# Altium project DARKYDEN.PrjPcb (part 18 of 18)

## Sheet CONNECTEUR_2.SchDoc: DARKYDEN_CONNECTEUR_2
size Letter; ApprovedBy: APPROUVÉ PAR; Author: Harold Malbrouck; Organization: Cegep Limoilou; Address1: 1300, 8e Avenue; Address2: Québec, QC; Address3: Canada; Address4: G1J 5L5; Revision: Rev.B; SheetNumber: 4; SheetTotal: 21
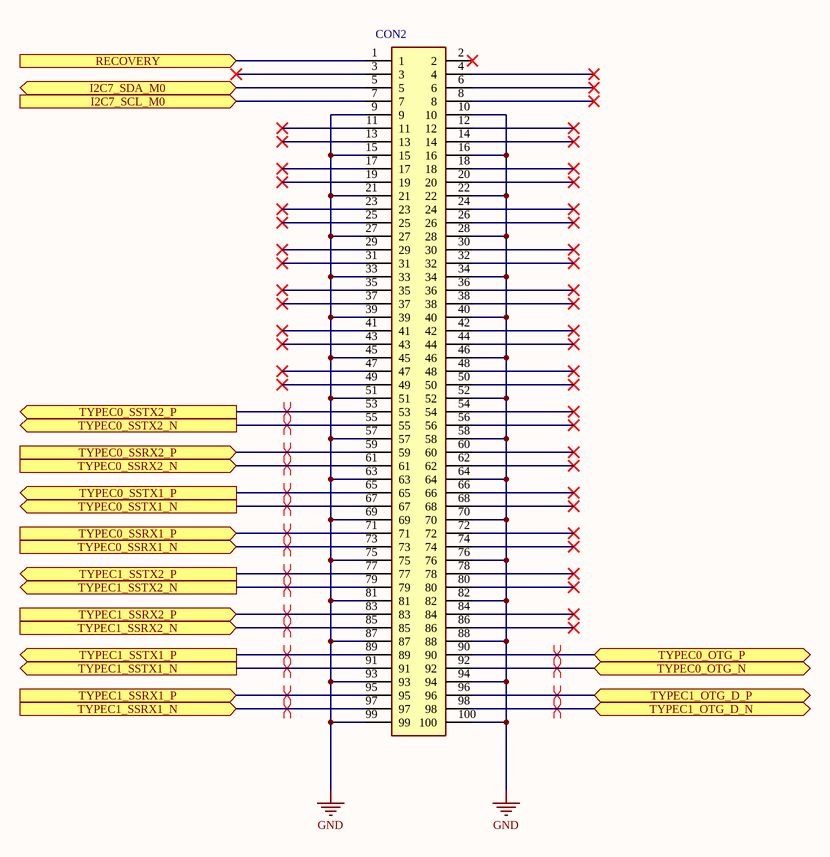
[diagram p18: CONNECTEUR_2.SchDoc]

### Parts
CON2  DF40HC  [DF40HC30100DS04V51_MOD]  (value not drawn)

### Ports
I2C7_SCL_M0 (in, see USBC_B[2D], USBC_B[3B]), I2C7_SDA_M0 (bidir, see USBC_B[3B], USBC_B[3D]), RECOVERY (in, see SystemCTL[1C]), TYPEC0_OTG_N (bidir, see USBC_A[2B]), TYPEC0_OTG_P (bidir, see USBC_A[2B]), TYPEC0_SSRX1_N (in, see USBC_A[1C], USBC_A[2B]), TYPEC0_SSRX1_P (in, see USBC_A[1C], USBC_A[2B]), TYPEC0_SSRX2_N (in, see USBC_A[2B], USBC_A[3C]), TYPEC0_SSRX2_P (in, see USBC_A[2B], USBC_A[3C]), TYPEC0_SSTX1_N (out, see USBC_A[2B], USBC_A[2C]), TYPEC0_SSTX1_P (out, see USBC_A[2B], USBC_A[2C]), TYPEC0_SSTX2_N (out, see USBC_A[2B], USBC_A[4C]), TYPEC0_SSTX2_P (out, see USBC_A[2B], USBC_A[4C]), TYPEC1_OTG_D_N (bidir, see USBC_B[2B]), TYPEC1_OTG_D_P (bidir, see USBC_B[2B]), TYPEC1_SSRX1_N (in, see USBC_B[1B], USBC_B[1C]), TYPEC1_SSRX1_P (in, see USBC_B[1B], USBC_B[1C]), TYPEC1_SSRX2_N (in, see USBC_B[1B], USBC_B[3C]), TYPEC1_SSRX2_P (in, see USBC_B[1B], USBC_B[3C]), TYPEC1_SSTX1_N (out, see USBC_B[1B], USBC_B[2C]), TYPEC1_SSTX1_P (out, see USBC_B[1B], USBC_B[2C]), TYPEC1_SSTX2_N (out, see USBC_B[1B], USBC_B[4C]), TYPEC1_SSTX2_P (out, see USBC_B[1B], USBC_B[4C])

### Nets
GND: CON2.9 CON2.10 CON2.15 CON2.16 CON2.21 CON2.22 CON2.27 CON2.28 CON2.33 CON2.34 CON2.39 CON2.40 CON2.45 CON2.46 CON2.51 CON2.52 CON2.57 CON2.58 CON2.63 CON2.64 CON2.69 CON2.70 CON2.75 CON2.76 CON2.81 CON2.82 CON2.87 CON2.88 CON2.93 CON2.94 CON2.99 CON2.100
I2C7_SCL_M0: CON2.7 ; port I2C7_SCL_M0
I2C7_SDA_M0: CON2.5 ; port I2C7_SDA_M0
RECOVERY: CON2.1 ; port RECOVERY
TYPEC0_OTG_N: CON2.92 ; port TYPEC0_OTG_N
TYPEC0_OTG_P: CON2.90 ; port TYPEC0_OTG_P
TYPEC0_SSRX1_N: CON2.73 ; port TYPEC0_SSRX1_N
TYPEC0_SSRX1_P: CON2.71 ; port TYPEC0_SSRX1_P
TYPEC0_SSRX2_N: CON2.61 ; port TYPEC0_SSRX2_N
TYPEC0_SSRX2_P: CON2.59 ; port TYPEC0_SSRX2_P
TYPEC0_SSTX1_N: CON2.67 ; port TYPEC0_SSTX1_N
TYPEC0_SSTX1_P: CON2.65 ; port TYPEC0_SSTX1_P
TYPEC0_SSTX2_N: CON2.55 ; port TYPEC0_SSTX2_N
TYPEC0_SSTX2_P: CON2.53 ; port TYPEC0_SSTX2_P
TYPEC1_OTG_D_N: CON2.98 ; port TYPEC1_OTG_D_N
TYPEC1_OTG_D_P: CON2.96 ; port TYPEC1_OTG_D_P
TYPEC1_SSRX1_N: CON2.97 ; port TYPEC1_SSRX1_N
TYPEC1_SSRX1_P: CON2.95 ; port TYPEC1_SSRX1_P
TYPEC1_SSRX2_N: CON2.85 ; port TYPEC1_SSRX2_N
TYPEC1_SSRX2_P: CON2.83 ; port TYPEC1_SSRX2_P
TYPEC1_SSTX1_N: CON2.91 ; port TYPEC1_SSTX1_N
TYPEC1_SSTX1_P: CON2.89 ; port TYPEC1_SSTX1_P
TYPEC1_SSTX2_N: CON2.79 ; port TYPEC1_SSTX2_N
TYPEC1_SSTX2_P: CON2.77 ; port TYPEC1_SSTX2_P

Not connected (* = marked no-connect by the designer): CON2 2* 3* 4* 6* 8* 11* 12* 13* 14* 17* 18* 19* 20* 23* 24* 25* 26* 29* 30* 31* 32* 35* 36* 37* 38* 41* 42* 43* 44* 47* 48* 49* 50* 54* 56* 60* 62* 66* 68* 72* 74* 78* 80* 84* 86*

### Layout directives
differential pair: TYPEC0_OTG_N, TYPEC0_OTG_P, TYPEC0_SSRX1_N, TYPEC0_SSRX1_P, TYPEC0_SSRX2_N, TYPEC0_SSRX2_P, TYPEC0_SSTX1_N, TYPEC0_SSTX1_P, TYPEC0_SSTX2_N, TYPEC0_SSTX2_P, TYPEC1_OTG_D_N, TYPEC1_OTG_D_P, TYPEC1_SSRX1_N, TYPEC1_SSRX1_P, TYPEC1_SSRX2_N, TYPEC1_SSRX2_P, TYPEC1_SSTX1_N, TYPEC1_SSTX1_P, TYPEC1_SSTX2_N, TYPEC1_SSTX2_P

### Notes on the sheet
- Titre :
- Conception :
- Date :
- Approbation :
- Heure :
- Révision :
- Feuille
- de
- Fichier :

### Library data of the parts
CON2 = DF40HC(3.0)-100DS-0.4V(51): Stacking Board Connector, DF40 Series, Receptacle, 0.4 mm, 100, Surface Mount, G; Manufacturer_Name: Hirose; Number of Positions: 100; Contact Resistance: 90mR; Contact Voltage Rating (AC): 30V; Current Rating: 300mA; Mated Stacking Heights: 3mm; Contact Pitch: 400um; Datasheet Link: https://componentsearchengine.com/Datasheets/1/DF40HC(3.0)-100DS-0.4V(51.pdf; Height: 3.05mm; Mouser Part Number: 798-DF40HC30100DS451; Mouser Price/Stock: https://www.mouser.co.uk/ProductDetail/Hirose-Connector/DF40HC3.0-100DS-0.4V51?qs=%252BAZVS4b%2FkgIV%252B3vHYy2dCA%3D%3D; Arrow Part Number: DF40HC(3.0)-100DS-0.4V(51; Arrow Price/Stock: https://www.arrow.com/en/products/df40hc-3.0-100ds-0.4v-51/hirose-electric; Supplier: Digikey; Supplier Part Number: 26-DF40HC(3.0)-100DS-0.4V(51)CT-ND; Manufacturer: Hirose; Manufacturer Part Number: DF40HC(3.0)-100DS-0.4V(51; RoHS: Yes; Category: Headers and Wire Housings; Stock: 5604; Pricing: 1=2.61, 10=2.219, 25=2.0796, 50=1.9804, 100=1.8858, 250=1.76764, 500=1.68326, 1000=1.6524 (USD); Mounting Technology: Surface Mount; Contact Plating: Gold; Contact Material: Nickel,Gold; Housing Color: Black; Min Operating Temperature: -35°C; Max Operating Temperature: 85°C; Package Quantity: 3000; Packaging: Tape and Reel; Number of Rows: 2; Connector Type: Receptacle; Series: DF40; Contact Voltage Rating (DC): 30V; Number of Contacts: 100; Orientation: Straight; Voltage Rating: 30V; Length: 22.6mm; Width: 3.38mm; ComponentLink1URL: https://datasheet.ciiva.com/13559/ed-df40-20140305-13559540.pdf?src-supplier=Mouser; ComponentLink1Description: https://datasheet.ciiva.com/13559/ed-df40-20140305-13559540.pdf?src-supplier=Mouser

## Sheet CONNECTEUR_3.SchDoc: DARKYDEN_CONNECTEUR_3
size Letter; ApprovedBy: APPROUVÉ PAR; Author: Harold Malbrouck; Organization: Cegep Limoilou; Address1: 1300, 8e Avenue; Address2: Québec, QC; Address3: Canada; Address4: G1J 5L5; Revision: Rev.C; SheetNumber: 5; SheetTotal: 21
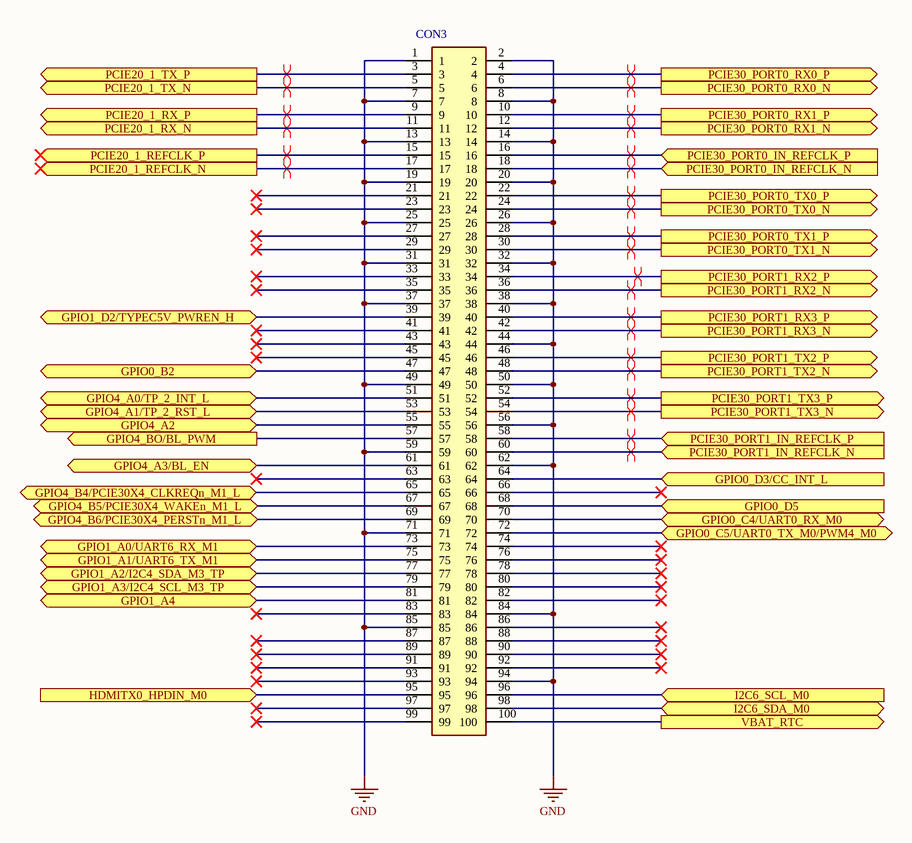
[diagram p19: CONNECTEUR_3.SchDoc]

### Parts
CON3  DF40HC  [DF40HC30100DS04V51_MOD]  (value not drawn)

### Ports
GPIO0_B2 (bidir, see WIFI[1B]), GPIO0_C4/UART0_RX_M0 (bidir, see WIFI[1B]), GPIO0_C5/UART0_TX_M0/PWM4_M0 (bidir, see WIFI[3B]), GPIO0_D3/CC_INT_L (in, see USBC_A[4B]), GPIO0_D5 (in, see USBC_B[4B]), GPIO1_A0/UART6_RX_M1 (bidir, see WIFI[3B]), GPIO1_A1/UART6_TX_M1 (bidir, see WIFI[3B]), GPIO1_A2/I2C4_SDA_M3_TP (bidir, see WIFI[3B]), GPIO1_A3/I2C4_SCL_M3_TP (bidir, see WIFI[3B]), GPIO1_A4 (bidir, see SystemCTL[3A]), GPIO1_D2/TYPEC5V_PWREN_H (bidir, see USBC_A[4A]), GPIO4_A0/TP_2_INT_L (bidir, see WIFI[1B]), GPIO4_A1/TP_2_RST_L (bidir, see WIFI[1B]), GPIO4_A2 (bidir, see WIFI[3B]), GPIO4_A3/BL_EN (bidir, see eDP[3C]), GPIO4_B4/PCIE30X4_CLKREQn_M1_L (bidir, see NVME[3B]), GPIO4_B5/PCIE30X4_WAKEn_M1_L (bidir, see NVME[3B]), GPIO4_B6/PCIE30X4_PERSTn_M1_L (bidir, see NVME[3B]), GPIO4_BO/BL_PWM (out, see eDP[3C]), HDMITX0_HPDIN_M0 (in, see eDP[3B]), I2C6_SCL_M0 (in, see USBC_A[2D], USBC_A[3B]), I2C6_SDA_M0 (bidir, see USBC_A[3B], USBC_A[3D]), PCIE20_1_REFCLK_N (out), PCIE20_1_REFCLK_P (out), PCIE20_1_RX_N (out, see WIFI[1B]), PCIE20_1_RX_P (out, see WIFI[1B]), PCIE20_1_TX_N (out, see WIFI[1B]), PCIE20_1_TX_P (out, see WIFI[1B]), PCIE30_PORT0_IN_REFCLK_N (in, see NVME[3D]), PCIE30_PORT0_IN_REFCLK_P (in, see NVME[3D]), PCIE30_PORT0_RX0_N (out, see NVME[1B]), PCIE30_PORT0_RX0_P (out, see NVME[1B]), PCIE30_PORT0_RX1_N (out, see NVME[1B]), PCIE30_PORT0_RX1_P (out, see NVME[1B]), PCIE30_PORT0_TX0_N (out, see NVME[1B]), PCIE30_PORT0_TX0_P (out, see NVME[1B]), PCIE30_PORT0_TX1_N (out, see NVME[1B]), PCIE30_PORT0_TX1_P (out, see NVME[1B]), PCIE30_PORT1_IN_REFCLK_N (in, see NVME[3D]), PCIE30_PORT1_IN_REFCLK_P (in, see NVME[3D]), PCIE30_PORT1_RX2_N (out, see NVME[1A]), PCIE30_PORT1_RX2_P (out, see NVME[1A]), PCIE30_PORT1_RX3_N (out, see NVME[1A]), PCIE30_PORT1_RX3_P (out, see NVME[1A]), PCIE30_PORT1_TX2_N (out, see NVME[1A]), PCIE30_PORT1_TX2_P (out, see NVME[1A]), PCIE30_PORT1_TX3_N (out, see NVME[1A]), PCIE30_PORT1_TX3_P (out, see NVME[1A]), VBAT_RTC (out, see SystemCTL[2C])

### Nets
GND: CON3.1 CON3.2 CON3.7 CON3.8 CON3.13 CON3.14 CON3.19 CON3.20 CON3.25 CON3.26 CON3.31 CON3.32 CON3.37 CON3.38 CON3.44 CON3.49 CON3.50 CON3.56 CON3.59 CON3.62 CON3.71 CON3.84 CON3.85 CON3.94
GPIO0_B2: CON3.47 ; port GPIO0_B2
GPIO0_C4/UART0_RX_M0: CON3.70 ; port GPIO0_C4/UART0_RX_M0
GPIO0_C5/UART0_TX_M0/PWM4_M0: CON3.72 ; port GPIO0_C5/UART0_TX_M0/PWM4_M0
GPIO0_D3/CC_INT_L: CON3.64 ; port GPIO0_D3/CC_INT_L
GPIO0_D5: CON3.68 ; port GPIO0_D5
GPIO1_A0/UART6_RX_M1: CON3.73 ; port GPIO1_A0/UART6_RX_M1
GPIO1_A1/UART6_TX_M1: CON3.75 ; port GPIO1_A1/UART6_TX_M1
GPIO1_A2/I2C4_SDA_M3_TP: CON3.77 ; port GPIO1_A2/I2C4_SDA_M3_TP
GPIO1_A3/I2C4_SCL_M3_TP: CON3.79 ; port GPIO1_A3/I2C4_SCL_M3_TP
GPIO1_A4: CON3.81 ; port GPIO1_A4
GPIO1_D2/TYPEC5V_PWREN_H: CON3.39 ; port GPIO1_D2/TYPEC5V_PWREN_H
GPIO4_A0/TP_2_INT_L: CON3.51 ; port GPIO4_A0/TP_2_INT_L
GPIO4_A1/TP_2_RST_L: CON3.53 ; port GPIO4_A1/TP_2_RST_L
GPIO4_A2: CON3.55 ; port GPIO4_A2
GPIO4_A3/BL_EN: CON3.61 ; port GPIO4_A3/BL_EN
GPIO4_B4/PCIE30X4_CLKREQn_M1_L: CON3.65 ; port GPIO4_B4/PCIE30X4_CLKREQn_M1_L
GPIO4_B5/PCIE30X4_WAKEn_M1_L: CON3.67 ; port GPIO4_B5/PCIE30X4_WAKEn_M1_L
GPIO4_B6/PCIE30X4_PERSTn_M1_L: CON3.69 ; port GPIO4_B6/PCIE30X4_PERSTn_M1_L
GPIO4_BO/BL_PWM: CON3.57 ; port GPIO4_BO/BL_PWM
HDMITX0_HPDIN_M0: CON3.95 ; port HDMITX0_HPDIN_M0
I2C6_SCL_M0: CON3.96 ; port I2C6_SCL_M0
I2C6_SDA_M0: CON3.98 ; port I2C6_SDA_M0
PCIE20_1_REFCLK_N: CON3.17 ; port PCIE20_1_REFCLK_N
PCIE20_1_REFCLK_P: CON3.15 ; port PCIE20_1_REFCLK_P
PCIE20_1_RX_N: CON3.11 ; port PCIE20_1_RX_N
PCIE20_1_RX_P: CON3.9 ; port PCIE20_1_RX_P
PCIE20_1_TX_N: CON3.5 ; port PCIE20_1_TX_N
PCIE20_1_TX_P: CON3.3 ; port PCIE20_1_TX_P
PCIE30_PORT0_IN_REFCLK_N: CON3.18 ; port PCIE30_PORT0_IN_REFCLK_N
PCIE30_PORT0_IN_REFCLK_P: CON3.16 ; port PCIE30_PORT0_IN_REFCLK_P
PCIE30_PORT0_RX0_N: CON3.6 ; port PCIE30_PORT0_RX0_N
PCIE30_PORT0_RX0_P: CON3.4 ; port PCIE30_PORT0_RX0_P
PCIE30_PORT0_RX1_N: CON3.12 ; port PCIE30_PORT0_RX1_N
PCIE30_PORT0_RX1_P: CON3.10 ; port PCIE30_PORT0_RX1_P
PCIE30_PORT0_TX0_N: CON3.24 ; port PCIE30_PORT0_TX0_N
PCIE30_PORT0_TX0_P: CON3.22 ; port PCIE30_PORT0_TX0_P
PCIE30_PORT0_TX1_N: CON3.30 ; port PCIE30_PORT0_TX1_N
PCIE30_PORT0_TX1_P: CON3.28 ; port PCIE30_PORT0_TX1_P
PCIE30_PORT1_IN_REFCLK_N: CON3.60 ; port PCIE30_PORT1_IN_REFCLK_N
PCIE30_PORT1_IN_REFCLK_P: CON3.58 ; port PCIE30_PORT1_IN_REFCLK_P
PCIE30_PORT1_RX2_N: CON3.36 ; port PCIE30_PORT1_RX2_N
PCIE30_PORT1_RX2_P: CON3.34 ; port PCIE30_PORT1_RX2_P
PCIE30_PORT1_RX3_N: CON3.42 ; port PCIE30_PORT1_RX3_N
PCIE30_PORT1_RX3_P: CON3.40 ; port PCIE30_PORT1_RX3_P
PCIE30_PORT1_TX2_N: CON3.48 ; port PCIE30_PORT1_TX2_N
PCIE30_PORT1_TX2_P: CON3.46 ; port PCIE30_PORT1_TX2_P
PCIE30_PORT1_TX3_N: CON3.54 ; port PCIE30_PORT1_TX3_N
PCIE30_PORT1_TX3_P: CON3.52 ; port PCIE30_PORT1_TX3_P
VBAT_RTC: CON3.100 ; port VBAT_RTC

Not connected (* = marked no-connect by the designer): CON3 21* 23* 27* 29* 33* 35* 41* 43* 45* 63* 66* 74* 76* 78* 80* 82* 83* 86* 87* 88* 89* 90* 91* 92* 93* 97* 99*

### Layout directives
differential pair: PCIE20_1_REFCLK_N, PCIE20_1_REFCLK_P, PCIE20_1_RX_N, PCIE20_1_RX_P, PCIE20_1_TX_N, PCIE20_1_TX_P, PCIE30_PORT0_IN_REFCLK_N, PCIE30_PORT0_IN_REFCLK_P, PCIE30_PORT0_RX0_N, PCIE30_PORT0_RX0_P, PCIE30_PORT0_RX1_N, PCIE30_PORT0_RX1_P, PCIE30_PORT0_TX0_N, PCIE30_PORT0_TX0_P, PCIE30_PORT0_TX1_N, PCIE30_PORT0_TX1_P, PCIE30_PORT1_IN_REFCLK_N, PCIE30_PORT1_IN_REFCLK_P, PCIE30_PORT1_RX2_N, PCIE30_PORT1_RX2_P, PCIE30_PORT1_RX3_N, PCIE30_PORT1_RX3_P, PCIE30_PORT1_TX2_N, PCIE30_PORT1_TX2_P, PCIE30_PORT1_TX3_N, PCIE30_PORT1_TX3_P

### Notes on the sheet
- Titre :
- Conception :
- Date :
- Approbation :
- Heure :
- Révision :
- Feuille
- de
- Fichier :

### Library data of the parts
CON3 = DF40HC(3.0)-100DS-0.4V(51): as CON2 on sheet CONNECTEUR_2; Datasheet Link: https://componentsearchengine.com/Datasheets/1/DF40HC(3.0)-100DS-0.4V(51.pdf; Height: 3.05mm; Mouser Part Number: 798-DF40HC30100DS451; Mouser Price/Stock: https://www.mouser.co.uk/ProductDetail/Hirose-Connector/DF40HC3.0-100DS-0.4V51?qs=%252BAZVS4b%2FkgIV%252B3vHYy2dCA%3D%3D; Arrow Part Number: DF40HC(3.0)-100DS-0.4V(51; Arrow Price/Stock: https://www.arrow.com/en/products/df40hc-3.0-100ds-0.4v-51/hirose-electric; Supplier: Digikey; Supplier Part Number: 26-DF40HC(3.0)-100DS-0.4V(51)CT-ND; Manufacturer: Hirose; Manufacturer Part Number: DF40HC(3.0)-100DS-0.4V(51; RoHS: Yes; Category: Headers and Wire Housings; Stock: 5604; Pricing: 1=2.61, 10=2.219, 25=2.0796, 50=1.9804, 100=1.8858, 250=1.76764, 500=1.68326, 1000=1.6524 (USD); Mounting Technology: Surface Mount; Contact Plating: Gold; Contact Material: Nickel,Gold; Housing Color: Black; Min Operating Temperature: -35°C; Max Operating Temperature: 85°C; Package Quantity: 3000; Packaging: Tape and Reel; Number of Rows: 2; Connector Type: Receptacle; Series: DF40; Contact Voltage Rating (DC): 30V; Number of Contacts: 100; Orientation: Straight; Voltage Rating: 30V; Length: 22.6mm; Width: 3.38mm; ComponentLink1URL: https://datasheet.ciiva.com/13559/ed-df40-20140305-13559540.pdf?src-supplier=Mouser; ComponentLink1Description: https://datasheet.ciiva.com/13559/ed-df40-20140305-13559540.pdf?src-supplier=Mouser

## Sheet CONNECTEUR_4.SchDoc: DARKYDEN_CONNECTEUR_4
size Letter; ApprovedBy: APPROUVÉ PAR; Author: Harold Malbrouck; Organization: Cegep Limoilou; Address1: 1300, 8e Avenue; Address2: Québec, QC; Address3: Canada; Address4: G1J 5L5; Revision: Rev.B; SheetNumber: 6; SheetTotal: 21
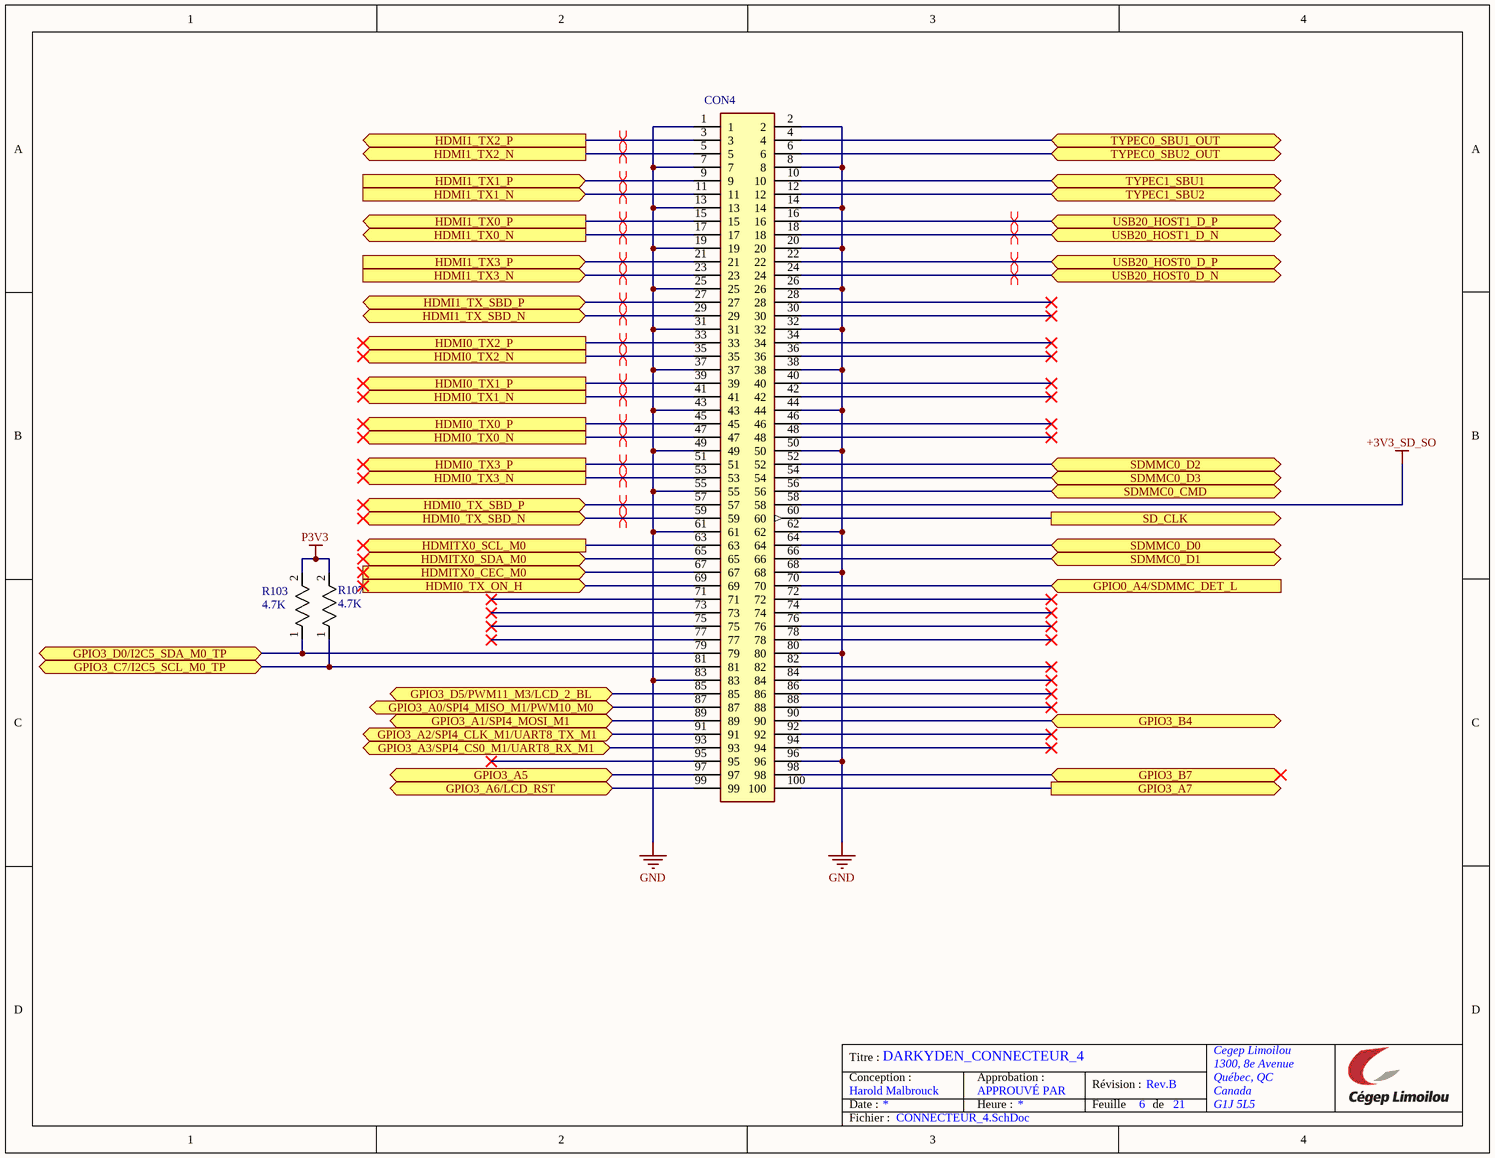
[diagram p20: CONNECTEUR_4.SchDoc]

### Parts
CON4  DF40HC  [DF40HC30100DS04V51_MOD]  (value not drawn)
R103  4.7K  [RESC1608X55N]
R107  4.7K  [RESC1608X55N]

### Ports
GPIO0_A4/SDMMC_DET_L (in, see SDCARD[1B]), GPIO3_A0/SPI4_MISO_M1/PWM10_M0 (bidir, see SystemCTL[2B]), GPIO3_A1/SPI4_MOSI_M1 (bidir, see SystemCTL[2B]), GPIO3_A2/SPI4_CLK_M1/UART8_TX_M1 (bidir, see SystemCTL[2B]), GPIO3_A3/SPI4_CS0_M1/UART8_RX_M1 (bidir, see SystemCTL[2B]), GPIO3_A5 (bidir, see SystemCTL[3A]), GPIO3_A6/LCD_RST (bidir, see WIFI[3B]), GPIO3_A7 (out, see eDP[1B]), GPIO3_B4 (bidir, see USBC_B[4A]), GPIO3_B7 (bidir), GPIO3_C7/I2C5_SCL_M0_TP (bidir, see POWERSYSTEM[2B]), GPIO3_D0/I2C5_SDA_M0_TP (bidir, see POWERSYSTEM[2B]), GPIO3_D5/PWM11_M3/LCD_2_BL (bidir, see WIFI[3B], WIFI[3C]), HDMI0_TX0_N (out), HDMI0_TX0_P (out), HDMI0_TX1_N (out), HDMI0_TX1_P (out), HDMI0_TX2_N (out), HDMI0_TX2_P (out), HDMI0_TX3_N (out), HDMI0_TX3_P (out), HDMI0_TX_ON_H (in), HDMI0_TX_SBD_N (bidir), HDMI0_TX_SBD_P (bidir), HDMI1_TX0_N (out, see eDP[3B]), HDMI1_TX0_P (out, see eDP[3B]), HDMI1_TX1_N (in, see eDP[3B]), HDMI1_TX1_P (in, see eDP[3B]), HDMI1_TX2_N (out, see eDP[3A]), HDMI1_TX2_P (out, see eDP[3A]), HDMI1_TX3_N (in, see eDP[3A]), HDMI1_TX3_P (in, see eDP[3A]), HDMI1_TX_SBD_N (bidir, see eDP[3B]), HDMI1_TX_SBD_P (bidir, see eDP[3B]), HDMITX0_CEC_M0 (in), HDMITX0_SCL_M0 (out), HDMITX0_SDA_M0 (bidir), SD_CLK (out, see SDCARD[3C]), SDMMC0_CMD (bidir, see SDCARD[3C]), SDMMC0_D0 (bidir, see SDCARD[1C]), SDMMC0_D1 (bidir, see SDCARD[1C]), SDMMC0_D2 (bidir, see SDCARD[4C]), SDMMC0_D3 (bidir, see SDCARD[4C]), TYPEC0_SBU1_OUT (bidir, see USBC_A[2A], USBC_A[3C]), TYPEC0_SBU2_OUT (bidir, see USBC_A[2B], USBC_A[3C]), TYPEC1_SBU1 (bidir, see USBC_B[1A], USBC_B[2C]), TYPEC1_SBU2 (bidir, see USBC_B[1A], USBC_B[2B]), USB20_HOST0_D_N (bidir, see USB2_0[1C]), USB20_HOST0_D_P (bidir, see USB2_0[1C]), USB20_HOST1_D_N (bidir, see WIFI[1A]), USB20_HOST1_D_P (bidir, see WIFI[1A])

### Nets
+3V3_SD_SO: CON4.58
GND: CON4.1 CON4.2 CON4.7 CON4.8 CON4.13 CON4.14 CON4.19 CON4.20 CON4.25 CON4.26 CON4.31 CON4.32 CON4.37 CON4.38 CON4.43 CON4.44 CON4.49 CON4.50 CON4.55 CON4.61 CON4.62 CON4.68 CON4.80 CON4.83 CON4.96
P3V3: R103.2 R107.2
GPIO0_A4/SDMMC_DET_L: CON4.70 ; port GPIO0_A4/SDMMC_DET_L
GPIO3_A0/SPI4_MISO_M1/PWM10_M0: CON4.87 ; port GPIO3_A0/SPI4_MISO_M1/PWM10_M0
GPIO3_A1/SPI4_MOSI_M1: CON4.89 ; port GPIO3_A1/SPI4_MOSI_M1
GPIO3_A2/SPI4_CLK_M1/UART8_TX_M1: CON4.91 ; port GPIO3_A2/SPI4_CLK_M1/UART8_TX_M1
GPIO3_A3/SPI4_CS0_M1/UART8_RX_M1: CON4.93 ; port GPIO3_A3/SPI4_CS0_M1/UART8_RX_M1
GPIO3_A5: CON4.97 ; port GPIO3_A5
GPIO3_A6/LCD_RST: CON4.99 ; port GPIO3_A6/LCD_RST
GPIO3_A7: CON4.100 ; port GPIO3_A7
GPIO3_B4: CON4.90 ; port GPIO3_B4
GPIO3_B7: CON4.98 ; port GPIO3_B7
GPIO3_C7/I2C5_SCL_M0_TP: CON4.81 R107.1 ; port GPIO3_C7/I2C5_SCL_M0_TP
GPIO3_D0/I2C5_SDA_M0_TP: CON4.79 R103.1 ; port GPIO3_D0/I2C5_SDA_M0_TP
GPIO3_D5/PWM11_M3/LCD_2_BL: CON4.85 ; port GPIO3_D5/PWM11_M3/LCD_2_BL
HDMI0_TX0_N: CON4.47 ; port HDMI0_TX0_N
HDMI0_TX0_P: CON4.45 ; port HDMI0_TX0_P
HDMI0_TX1_N: CON4.41 ; port HDMI0_TX1_N
HDMI0_TX1_P: CON4.39 ; port HDMI0_TX1_P
HDMI0_TX2_N: CON4.35 ; port HDMI0_TX2_N
HDMI0_TX2_P: CON4.33 ; port HDMI0_TX2_P
HDMI0_TX3_N: CON4.53 ; port HDMI0_TX3_N
HDMI0_TX3_P: CON4.51 ; port HDMI0_TX3_P
HDMI0_TX_ON_H: CON4.69 ; port HDMI0_TX_ON_H
HDMI0_TX_SBD_N: CON4.59 ; port HDMI0_TX_SBD_N
HDMI0_TX_SBD_P: CON4.57 ; port HDMI0_TX_SBD_P
HDMI1_TX0_N: CON4.17 ; port HDMI1_TX0_N
HDMI1_TX0_P: CON4.15 ; port HDMI1_TX0_P
HDMI1_TX1_N: CON4.11 ; port HDMI1_TX1_N
HDMI1_TX1_P: CON4.9 ; port HDMI1_TX1_P
HDMI1_TX2_N: CON4.5 ; port HDMI1_TX2_N
HDMI1_TX2_P: CON4.3 ; port HDMI1_TX2_P
HDMI1_TX3_N: CON4.23 ; port HDMI1_TX3_N
HDMI1_TX3_P: CON4.21 ; port HDMI1_TX3_P
HDMI1_TX_SBD_N: CON4.29 ; port HDMI1_TX_SBD_N
HDMI1_TX_SBD_P: CON4.27 ; port HDMI1_TX_SBD_P
HDMITX0_CEC_M0: CON4.67 ; port HDMITX0_CEC_M0
HDMITX0_SCL_M0: CON4.63 ; port HDMITX0_SCL_M0
HDMITX0_SDA_M0: CON4.65 ; port HDMITX0_SDA_M0
SD_CLK: CON4.60 ; port SD_CLK
SDMMC0_CMD: CON4.56 ; port SDMMC0_CMD
SDMMC0_D0: CON4.64 ; port SDMMC0_D0
SDMMC0_D1: CON4.66 ; port SDMMC0_D1
SDMMC0_D2: CON4.52 ; port SDMMC0_D2
SDMMC0_D3: CON4.54 ; port SDMMC0_D3
TYPEC0_SBU1_OUT: CON4.4 ; port TYPEC0_SBU1_OUT
TYPEC0_SBU2_OUT: CON4.6 ; port TYPEC0_SBU2_OUT
TYPEC1_SBU1: CON4.10 ; port TYPEC1_SBU1
TYPEC1_SBU2: CON4.12 ; port TYPEC1_SBU2
USB20_HOST0_D_N: CON4.24 ; port USB20_HOST0_D_N
USB20_HOST0_D_P: CON4.22 ; port USB20_HOST0_D_P
USB20_HOST1_D_N: CON4.18 ; port USB20_HOST1_D_N
USB20_HOST1_D_P: CON4.16 ; port USB20_HOST1_D_P

Not connected (* = marked no-connect by the designer): CON4 28* 30* 34* 36* 40* 42* 46* 48* 71* 72* 73* 74* 75* 76* 77* 78* 82* 84* 86* 88* 92* 94* 95*

### Layout directives
differential pair: HDMI0_TX0_N, HDMI0_TX0_P, HDMI0_TX1_N, HDMI0_TX1_P, HDMI0_TX2_N, HDMI0_TX2_P, HDMI0_TX3_N, HDMI0_TX3_P, HDMI0_TX_SBD_N, HDMI0_TX_SBD_P, HDMI1_TX0_N, HDMI1_TX0_P, HDMI1_TX1_N, HDMI1_TX1_P, HDMI1_TX2_N, HDMI1_TX2_P, HDMI1_TX3_N, HDMI1_TX3_P, HDMI1_TX_SBD_N, HDMI1_TX_SBD_P, USB20_HOST0_D_N, USB20_HOST0_D_P, USB20_HOST1_D_N, USB20_HOST1_D_P

### Notes on the sheet
- Titre :
- Conception :
- Date :
- Approbation :
- Heure :
- Révision :
- Feuille
- de
- Fichier :

### Library data of the parts
CON4 = DF40HC(3.0)-100DS-0.4V(51): as CON2 on sheet CONNECTEUR_2; Datasheet Link: https://componentsearchengine.com/Datasheets/1/DF40HC(3.0)-100DS-0.4V(51.pdf; Height: 3.05mm; Mouser Part Number: 798-DF40HC30100DS451; Mouser Price/Stock: https://www.mouser.co.uk/ProductDetail/Hirose-Connector/DF40HC3.0-100DS-0.4V51?qs=%252BAZVS4b%2FkgIV%252B3vHYy2dCA%3D%3D; Arrow Part Number: DF40HC(3.0)-100DS-0.4V(51; Arrow Price/Stock: https://www.arrow.com/en/products/df40hc-3.0-100ds-0.4v-51/hirose-electric; Supplier: Digikey; Supplier Part Number: 26-DF40HC(3.0)-100DS-0.4V(51)CT-ND; Manufacturer: Hirose; Manufacturer Part Number: DF40HC(3.0)-100DS-0.4V(51; RoHS: Yes; Category: Headers and Wire Housings; Stock: 5604; Pricing: 1=2.61, 10=2.219, 25=2.0796, 50=1.9804, 100=1.8858, 250=1.76764, 500=1.68326, 1000=1.6524 (USD); Mounting Technology: Surface Mount; Contact Plating: Gold; Contact Material: Nickel,Gold; Housing Color: Black; Min Operating Temperature: -35°C; Max Operating Temperature: 85°C; Package Quantity: 3000; Packaging: Tape and Reel; Number of Rows: 2; Connector Type: Receptacle; Series: DF40; Contact Voltage Rating (DC): 30V; Number of Contacts: 100; Orientation: Straight; Voltage Rating: 30V; Length: 22.6mm; Width: 3.38mm; ComponentLink1URL: https://datasheet.ciiva.com/13559/ed-df40-20140305-13559540.pdf?src-supplier=Mouser; ComponentLink1Description: https://datasheet.ciiva.com/13559/ed-df40-20140305-13559540.pdf?src-supplier=Mouser
R103 R107 = ERA-3AEB472V: 4.7K Ohm 0.1% 0.1W 0603 ±25ppm/°C Molded SMD Punched Carrier T/R; Mfr_Name: Panasonic; Voltage Rating: 75V; Value: 4.7kR; Power Rating: 100mW; Supplier: Digikey; Supplier Part Number: P4.7KDBCT-ND; Manufacturer: Panasonic; Manufacturer Part Number: ERA-3AEB472V; RoHS: Yes; Category: Chip SMD Resistors; Stock: 284751; Pricing: 1=0.1, 10=0.065, 50=0.0574, 100=0.0541, 500=0.0475, 1000=0.045 (USD); Mounting Technology: Surface Mount; Case/Package: 0603; Pins: 2; Contact Plating: Tin; Case Code (Metric): 1608; Case Code (Imperial): 0603; Min Operating Temperature: -55°C; Max Operating Temperature: 155°C; Packaging: Tape and Reel; Package Quantity: 5000; Termination: SMD/SMT; Series: ERA-3A; Tolerance: 0.1%; Resistor Type: Thin Film; Number of Terminations: 2; Temperature Coefficient: 25ppm/°C; Max Power Dissipation: 100mW; Voltage Rating (DC): 75V; Working Voltage: 75V; Construction: Rectangular; Resistance Tolerance: 0.1%; Technology: THIN FILM; Features: Automotive AEC-Q200; Length: 1.6mm; Width: 0.8mm; Height: 0.45mm; Depth: 0.8mm; Ratings: AEC-Q200; Radiation Hardening: No; Reach SVHC Compliant: No; RoHS Compliant: Yes; Military Standard: Not; Lead Free: Lead Free; ComponentLink1URL: https://datasheet.ciiva.com/11808/0900766b80fe20f7-11808039.pdf?src-supplier=Rs; ComponentLink1Description: https://datasheet.ciiva.com/11808/0900766b80fe20f7-11808039.pdf?src-supplier=Rs; ComponentLink2URL: https://datasheet.ciiva.com/29183/451124-da-01-en-widerstand-0603-era-29183789.pdf?src-supplier=Conrad; ComponentLink2Description: https://datasheet.ciiva.com/29183/451124-da-01-en-widerstand-0603-era-29183789.pdf?src-supplier=Conrad; ComponentLink3URL: https://datasheet.ciiva.com/22781/485442-22781497.pdf?src-supplier=Farnell; ComponentLink3Description: https://datasheet.ciiva.com/22781/485442-22781497.pdf?src-supplier=Farnell; ComponentLink4URL: https://datasheet.ciiva.com/43455/485442-43455227.pdf?src-supplier=Farnell; ComponentLink4Description: https://datasheet.ciiva.com/43455/485442-43455227.pdf?src-supplier=Farnell; ComponentLink5URL: https://datasheet.ciiva.com/9116/aoa0000ce26-9116681.pdf?src-supplier=Avnet; ComponentLink5Description: https://datasheet.ciiva.com/9116/aoa0000ce26-9116681.pdf?src-supplier=Avnet; ComponentLink6URL: https://datasheet.ciiva.com/9117/aoa0000ce26-9117707.pdf?src-supplier=Avnet; ComponentLink6Description: https://datasheet.ciiva.com/9117/aoa0000ce26-9117707.pdf?src-supplier=Avnet; ComponentLink7URL: https://datasheet.ciiva.com/48425/era-eng-tds-48425470.pdf?src-supplier=Distrelec; ComponentLink7Description: https://datasheet.ciiva.com/48425/era-eng-tds-48425470.pdf?src-supplier=Distrelec; ComponentLink8URL: https://datasheet.ciiva.com/46422/485442-46422693.pdf?src-supplier=Element14; ComponentLink8Description: https://datasheet.ciiva.com/46422/485442-46422693.pdf?src-supplier=Element14; ComponentLink9URL: https://datasheet.ciiva.com/30078/54aoa0000ce26-30078815.pdf?src-supplier=Onlinecomponents.com; ComponentLink9Description: https://datasheet.ciiva.com/30078/54aoa0000ce26-30078815.pdf?src-supplier=Onlinecomponents.com; ComponentLink10URL: https://datasheet.ciiva.com/22743/485442-22743061.pdf?src-supplier=Element14; ComponentLink10Description: https://datasheet.ciiva.com/22743/485442-22743061.pdf?src-supplier=Element14

## Nets that join several sheets
+1V8: SDCARD (R49.2), SystemCTL (5 pins), 1V8_3V3_5V (C67.2 IC7.5 TP_1V8.TP)
+3V3: USBC_A (C9.2 R4.1 R5.1 U3.4), USBC_B (5 pins), NVME (R18.2 R22.2), ETHERNET (R14.2 R15.2), eDP (C21.2 U13.1), USB2_0 (15 pins), SystemCTL (R77.2), USB2_0_Connector (J4.6 J4.8), 1V8_3V3_5V (10 pins)
+3V3_NVME: NVME (9 pins), POWER_PCie (7 pins)
+3V3_SD_SO: SDCARD (C35.2 C36.2 J7.4), CONNECTEUR_4 (CON4.58)
+3V3_WIFI: WIFI (WIFI.2 WIFI.4 WIFI.72 WIFI.74), POWER_PCie (7 pins)
+5V: USBC_A (7 pins), USBC_B (7 pins), NVME (C26.2 U16.1), USB2_0 (IC18.5 IC18.7 IC19.7 IC20.7), 1V8_3V3_5V (8 pins)
+12: 12V_PWR (5 pins), 1V8_3V3_5V (R79.1 R80.1 R84.1 R85.1), POWER_PCie (R93.1 R94.1 R98.1 R99.1), CONNECTEUR_1 (R6.2 R7.2)
GND: USBC_A (32 pins), USBC_B (32 pins), WIFI (13 pins), NVME (41 pins), ETHERNET (7 pins), SDCARD (11 pins), eDP (21 pins), USB2_0 (32 pins), SystemCTL (21 pins), USB2_0_Connector (17 pins), POWERSYSTEM (56 pins), BATTERY_GESTION (26 pins), 12V_PWR (24 pins), P3V3_PP5V_GESTION (17 pins), 1V8_3V3_5V (25 pins), POWER_PCie (18 pins), CONNECTEUR_1 (26 pins), CONNECTEUR_2 (32 pins), CONNECTEUR_3 (24 pins), CONNECTEUR_4 (25 pins)
P3V3: POWERSYSTEM (C87.2 U25.38), P3V3_PP5V_GESTION (C152.2 IC16.5), CONNECTEUR_4 (R103.2 R107.2)
PACK+: POWERSYSTEM (7 pins), BATTERY_GESTION (12 pins)
PP5V: POWERSYSTEM (U25.34 U25.35), P3V3_PP5V_GESTION (8 pins)
PWR1: USB2_0 (BR2.1 IC18.6 IC18.8 IC19.8), USB2_0_Connector (C168.1 C169.1 FB1.1)
PWR2: USB2_0 (BR3.1 IC19.5), USB2_0_Connector (C172.1 C173.1 FB3.1)
PWR3: USB2_0 (BR5.1 IC20.8), USB2_0_Connector (C176.1 C177.1 FB5.1)
PWR4: USB2_0 (BR4.1 IC20.5), USB2_0_Connector (C180.1 C181.1 FB7.1)
VCC_SYS: eDP (eDP1.2 eDP1.3 eDP1.4 eDP1.5), POWERSYSTEM (8 pins), 12V_PWR (10 pins), P3V3_PP5V_GESTION (5 pins)
BOOT_SARADC_IN0: SystemCTL (C43.1 R72.1), CONNECTEUR_1 (CON1.15)
DN1_OUT_N: USB2_0 (BR2.4 L20.3), USB2_0_Connector (J4.3)
DN1_OUT_P: USB2_0 (BR2.2 L20.4), USB2_0_Connector (J4.5)
DN2_OUT_N: USB2_0 (BR3.4 L21.3), USB2_0_Connector (Trackpad.5)
DN2_OUT_P: USB2_0 (BR3.2 L21.4), USB2_0_Connector (Trackpad.4)
DN3_OUT_N: USB2_0 (BR5.4 L23.3), USB2_0_Connector (USB1.2)
DN3_OUT_P: USB2_0 (BR5.2 L23.4), USB2_0_Connector (USB1.3)
DN4_OUT_N: USB2_0 (BR4.4 L22.3), USB2_0_Connector (USB2.2)
DN4_OUT_P: USB2_0 (BR4.2 L22.4), USB2_0_Connector (USB2.3)
GPIO0_A4/SDMMC_DET_L: SDCARD (R49.1 R50.1), CONNECTEUR_4 (CON4.70)
GPIO0_B2: WIFI (WIFI.21), CONNECTEUR_3 (CON3.47)
GPIO0_C4/UART0_RX_M0: WIFI (R41.1), CONNECTEUR_3 (CON3.70)
GPIO0_C5/UART0_TX_M0/PWM4_M0: WIFI (WIFI.20), CONNECTEUR_3 (CON3.72)
GPIO0_D3/CC_INT_L: USBC_A (U3.5), CONNECTEUR_3 (CON3.64)
GPIO0_D5: USBC_B (R13.1 U9.5), CONNECTEUR_3 (CON3.68)
GPIO1_A0/UART6_RX_M1: WIFI (WIFI.22), CONNECTEUR_3 (CON3.73)
GPIO1_A1/UART6_TX_M1: WIFI (WIFI.32), CONNECTEUR_3 (CON3.75)
GPIO1_A2/I2C4_SDA_M3_TP: WIFI (WIFI.36), CONNECTEUR_3 (CON3.77)
GPIO1_A3/I2C4_SCL_M3_TP: WIFI (WIFI.34), CONNECTEUR_3 (CON3.79)
GPIO1_A4: SystemCTL (IC4.2), CONNECTEUR_3 (CON3.81)
GPIO1_D2/TYPEC5V_PWREN_H: USBC_A (R173.2), CONNECTEUR_3 (CON3.39)
GPIO2_A6: WIFI (WIFI.13), CONNECTEUR_1 (CON1.79)
GPIO2_A7: WIFI (WIFI.15), CONNECTEUR_1 (CON1.81)
GPIO2_B0: WIFI (WIFI.17), CONNECTEUR_1 (CON1.83)
GPIO2_B1: WIFI (WIFI.19), CONNECTEUR_1 (CON1.85)
GPIO2_B2: WIFI (WIFI.11), CONNECTEUR_1 (CON1.87)
GPIO2_B3: WIFI (WIFI.9), CONNECTEUR_1 (CON1.89)
GPIO2_B7: WIFI (WIFI.8), CONNECTEUR_1 (CON1.99)
GPIO2_C0: WIFI (WIFI.10), CONNECTEUR_1 (CON1.21)
GPIO2_C3: WIFI (R42.2), CONNECTEUR_1 (CON1.27)
GPIO3_A0/SPI4_MISO_M1/PWM10_M0: SystemCTL (IC4.3), CONNECTEUR_4 (CON4.87)
GPIO3_A1/SPI4_MOSI_M1: SystemCTL (IC4.5), CONNECTEUR_4 (CON4.89)
GPIO3_A2/SPI4_CLK_M1/UART8_TX_M1: SystemCTL (IC4.6 R76.1), CONNECTEUR_4 (CON4.91)
GPIO3_A3/SPI4_CS0_M1/UART8_RX_M1: SystemCTL (IC4.7 R75.1), CONNECTEUR_4 (CON4.93)
GPIO3_A5: SystemCTL (IC4.1), CONNECTEUR_4 (CON4.97)
GPIO3_A6/LCD_RST: WIFI (WIFI.42), CONNECTEUR_4 (CON4.99)
GPIO3_A7: eDP (U13.3), CONNECTEUR_4 (CON4.100)
GPIO3_B4: USBC_B (R174.2), CONNECTEUR_4 (CON4.90)
GPIO3_C7/I2C5_SCL_M0_TP: POWERSYSTEM (U25.9), CONNECTEUR_4 (CON4.81 R107.1)
GPIO3_D0/I2C5_SDA_M0_TP: POWERSYSTEM (U25.8), CONNECTEUR_4 (CON4.79 R103.1)
GPIO3_D5/PWM11_M3/LCD_2_BL: WIFI (WIFI.54 WIFI.70), CONNECTEUR_4 (CON4.85)
GPIO4_A0/TP_2_INT_L: WIFI (WIFI.53), CONNECTEUR_3 (CON3.51)
GPIO4_A1/TP_2_RST_L: WIFI (WIFI.55), CONNECTEUR_3 (CON3.53)
GPIO4_A2: WIFI (WIFI.52), CONNECTEUR_3 (CON3.55)
GPIO4_A3/BL_EN: eDP (eDP1.9), CONNECTEUR_3 (CON3.61)
GPIO4_B4/PCIE30X4_CLKREQn_M1_L: NVME (R20.2), CONNECTEUR_3 (CON3.65)
GPIO4_B5/PCIE30X4_WAKEn_M1_L: NVME (R21.2), CONNECTEUR_3 (CON3.67)
GPIO4_B6/PCIE30X4_PERSTn_M1_L: NVME (R19.2), CONNECTEUR_3 (CON3.69)
GPIO4_BO/BL_PWM: eDP (eDP1.8), CONNECTEUR_3 (CON3.57)
GPIO4_C3: WIFI (R43.2), CONNECTEUR_1 (CON1.28)
GPIO4_C4/MIPI_CAM1_RESET_L: WIFI (WIFI.56), CONNECTEUR_1 (CON1.30)
HDMI1_TX0_N: eDP (eDP1.29), CONNECTEUR_4 (CON4.17)
HDMI1_TX0_P: eDP (eDP1.28), CONNECTEUR_4 (CON4.15)
HDMI1_TX1_N: eDP (eDP1.32), CONNECTEUR_4 (CON4.11)
HDMI1_TX1_P: eDP (eDP1.31), CONNECTEUR_4 (CON4.9)
HDMI1_TX2_N: eDP (eDP1.35), CONNECTEUR_4 (CON4.5)
HDMI1_TX2_P: eDP (eDP1.34), CONNECTEUR_4 (CON4.3)
HDMI1_TX3_N: eDP (eDP1.38), CONNECTEUR_4 (CON4.23)
HDMI1_TX3_P: eDP (eDP1.37), CONNECTEUR_4 (CON4.21)
HDMI1_TX_SBD_N: eDP (eDP1.25), CONNECTEUR_4 (CON4.29)
HDMI1_TX_SBD_P: eDP (eDP1.26), CONNECTEUR_4 (CON4.27)
HDMITX0_HPDIN_M0: eDP (eDP1.14), CONNECTEUR_3 (CON3.95)
I2C6_SCL_M0: USBC_A (R4.2 U3.6), CONNECTEUR_3 (CON3.96)
I2C6_SDA_M0: USBC_A (R5.2 U3.7), CONNECTEUR_3 (CON3.98)
I2C7_SCL_M0: USBC_B (R11.2 U9.6), CONNECTEUR_2 (CON2.7)
I2C7_SDA_M0: USBC_B (R12.2 U9.7), CONNECTEUR_2 (CON2.5)
LED2_25GLAN_1GLED: ETHERNET (R16.1), CONNECTEUR_1 (CON1.74)
LED3_25GLAN_25GLED: ETHERNET (R17.1), CONNECTEUR_1 (CON1.72)
P25G_MDI0_N: ETHERNET (L3.3), CONNECTEUR_1 (CON1.80)
P25G_MDI0_P: ETHERNET (L3.4), CONNECTEUR_1 (CON1.78)
P25G_MDI1_N: ETHERNET (L4.4), CONNECTEUR_1 (CON1.86)
P25G_MDI1_P: ETHERNET (L4.3), CONNECTEUR_1 (CON1.84)
P25G_MDI2_N: ETHERNET (L5.3), CONNECTEUR_1 (CON1.92)
P25G_MDI2_P: ETHERNET (L5.4), CONNECTEUR_1 (CON1.90)
P25G_MDI3_N: ETHERNET (L6.4), CONNECTEUR_1 (CON1.98)
P25G_MDI3_P: ETHERNET (L6.3), CONNECTEUR_1 (CON1.96)
PCIE20_1_RX_N: WIFI (WIFI.43), CONNECTEUR_3 (CON3.11)
PCIE20_1_RX_P: WIFI (WIFI.41), CONNECTEUR_3 (CON3.9)
PCIE20_1_TX_N: WIFI (WIFI.37), CONNECTEUR_3 (CON3.5)
PCIE20_1_TX_P: WIFI (WIFI.35), CONNECTEUR_3 (CON3.3)
PCIE30_PORT0_IN_REFCLK_N: NVME (R35.2 R37.1), CONNECTEUR_3 (CON3.18)
PCIE30_PORT0_IN_REFCLK_P: NVME (R34.2 R38.1), CONNECTEUR_3 (CON3.16)
PCIE30_PORT0_RX0_N: NVME (NVME.41), CONNECTEUR_3 (CON3.6)
PCIE30_PORT0_RX0_P: NVME (NVME.43), CONNECTEUR_3 (CON3.4)
PCIE30_PORT0_RX1_N: NVME (NVME.29), CONNECTEUR_3 (CON3.12)
PCIE30_PORT0_RX1_P: NVME (NVME.31), CONNECTEUR_3 (CON3.10)
PCIE30_PORT0_TX0_N: NVME (NVME.47), CONNECTEUR_3 (CON3.24)
PCIE30_PORT0_TX0_P: NVME (NVME.49), CONNECTEUR_3 (CON3.22)
PCIE30_PORT0_TX1_N: NVME (NVME.35), CONNECTEUR_3 (CON3.30)
PCIE30_PORT0_TX1_P: NVME (NVME.37), CONNECTEUR_3 (CON3.28)
PCIE30_PORT1_IN_REFCLK_N: NVME (R33.2 R39.1), CONNECTEUR_3 (CON3.60)
PCIE30_PORT1_IN_REFCLK_P: NVME (R32.2 R40.1), CONNECTEUR_3 (CON3.58)
PCIE30_PORT1_RX2_N: NVME (NVME.17), CONNECTEUR_3 (CON3.36)
PCIE30_PORT1_RX2_P: NVME (NVME.19), CONNECTEUR_3 (CON3.34)
PCIE30_PORT1_RX3_N: NVME (NVME.5), CONNECTEUR_3 (CON3.42)
PCIE30_PORT1_RX3_P: NVME (NVME.7), CONNECTEUR_3 (CON3.40)
PCIE30_PORT1_TX2_N: NVME (NVME.23), CONNECTEUR_3 (CON3.48)
PCIE30_PORT1_TX2_P: NVME (NVME.25), CONNECTEUR_3 (CON3.46)
PCIE30_PORT1_TX3_N: NVME (NVME.11), CONNECTEUR_3 (CON3.54)
PCIE30_PORT1_TX3_P: NVME (NVME.13), CONNECTEUR_3 (CON3.52)
PMIC_EXT_EN_OUT: 1V8_3V3_5V (R81.1 R86.1), POWER_PCie (R95.1 R100.1), CONNECTEUR_1 (CON1.19)
PWRON_L: SystemCTL (C41.1 R70.1), CONNECTEUR_1 (CON1.17)
RECOVERY: SystemCTL (C44.1 R73.1), CONNECTEUR_2 (CON2.1)
RESET_L: SystemCTL (C42.1 R71.1), CONNECTEUR_1 (CON1.16)
SARADC_VIN6_HW_ID2: USB2_0_Connector (J4.4 R51.2), CONNECTEUR_1 (CON1.14)
SD_CLK: SDCARD (L29.4), CONNECTEUR_4 (CON4.60)
SDMMC0_CMD: SDCARD (R46.1), CONNECTEUR_4 (CON4.56)
SDMMC0_D0: SDCARD (R47.1), CONNECTEUR_4 (CON4.64)
SDMMC0_D1: SDCARD (R48.1), CONNECTEUR_4 (CON4.66)
SDMMC0_D2: SDCARD (R44.1), CONNECTEUR_4 (CON4.52)
SDMMC0_D3: SDCARD (R45.1), CONNECTEUR_4 (CON4.54)
TYPEC0_OTG_N: USBC_A (L1.3), CONNECTEUR_2 (CON2.92)
TYPEC0_OTG_P: USBC_A (L1.4), CONNECTEUR_2 (CON2.90)
TYPEC0_SBU1_OUT: USBC_A (J2.A8 U5.4 U5.7), CONNECTEUR_4 (CON4.4)
TYPEC0_SBU2_OUT: USBC_A (J2.B8 U5.5 U5.6), CONNECTEUR_4 (CON4.6)
TYPEC0_SSRX1_N: USBC_A (J2.B10 U4.1 U4.10), CONNECTEUR_2 (CON2.73)
TYPEC0_SSRX1_P: USBC_A (J2.B11 U4.2 U4.9), CONNECTEUR_2 (CON2.71)
TYPEC0_SSRX2_N: USBC_A (J2.A10 U6.1 U6.10), CONNECTEUR_2 (CON2.61)
TYPEC0_SSRX2_P: USBC_A (J2.A11 U6.2 U6.9), CONNECTEUR_2 (CON2.59)
TYPEC0_SSTX1_N: USBC_A (J2.A3 U4.5 U4.6), CONNECTEUR_2 (CON2.67)
TYPEC0_SSTX1_P: USBC_A (J2.A2 U4.4 U4.7), CONNECTEUR_2 (CON2.65)
TYPEC0_SSTX2_N: USBC_A (J2.B3 U6.5 U6.6), CONNECTEUR_2 (CON2.55)
TYPEC0_SSTX2_P: USBC_A (J2.B2 U6.4 U6.7), CONNECTEUR_2 (CON2.53)
TYPEC1_OTG_D_N: USBC_B (L2.3), CONNECTEUR_2 (CON2.98)
TYPEC1_OTG_D_P: USBC_B (L2.4), CONNECTEUR_2 (CON2.96)
TYPEC1_SBU1: USBC_B (J3.A8 U11.2 U11.9), CONNECTEUR_4 (CON4.10)
TYPEC1_SBU2: USBC_B (J3.B8 U11.1 U11.10), CONNECTEUR_4 (CON4.12)
TYPEC1_SSRX1_N: USBC_B (J3.B10 U10.1 U10.10), CONNECTEUR_2 (CON2.97)
TYPEC1_SSRX1_P: USBC_B (J3.B11 U10.2 U10.9), CONNECTEUR_2 (CON2.95)
TYPEC1_SSRX2_N: USBC_B (J3.A10 U12.1 U12.10), CONNECTEUR_2 (CON2.85)
TYPEC1_SSRX2_P: USBC_B (J3.A11 U12.2 U12.9), CONNECTEUR_2 (CON2.83)
TYPEC1_SSTX1_N: USBC_B (J3.A3 U10.5 U10.6), CONNECTEUR_2 (CON2.91)
TYPEC1_SSTX1_P: USBC_B (J3.A2 U10.4 U10.7), CONNECTEUR_2 (CON2.89)
TYPEC1_SSTX2_N: USBC_B (J3.B3 U12.5 U12.6), CONNECTEUR_2 (CON2.79)
TYPEC1_SSTX2_P: USBC_B (J3.B2 U12.4 U12.7), CONNECTEUR_2 (CON2.77)
UART2_RX_M0_DEBUG: SystemCTL (D3.2 R77.1), CONNECTEUR_1 (CON1.22)
UART2_TX_M0_DEBUG: SystemCTL (R78.1), CONNECTEUR_1 (CON1.20)
USB20_HOST0_D_N: USB2_0 (BR1.4 L19.3), CONNECTEUR_4 (CON4.24)
USB20_HOST0_D_P: USB2_0 (BR1.2 L19.4), CONNECTEUR_4 (CON4.22)
USB20_HOST1_D_N: WIFI (WIFI.5), CONNECTEUR_4 (CON4.18)
USB20_HOST1_D_P: WIFI (WIFI.3), CONNECTEUR_4 (CON4.16)
VBAT_RTC: SystemCTL (RTC_BAT.2), CONNECTEUR_3 (CON3.100)
VDC_MODE: SystemCTL (R74.2), CONNECTEUR_1 (CON1.18)
WIFI_REFCLK_A_N: WIFI (WIFI.49), NVME (R119.2 R159.1)
WIFI_REFCLK_A_P: WIFI (WIFI.47), NVME (R118.2 R121.1)